# EAGLE schematic REED-tuer (EAGLE 9.3.2)
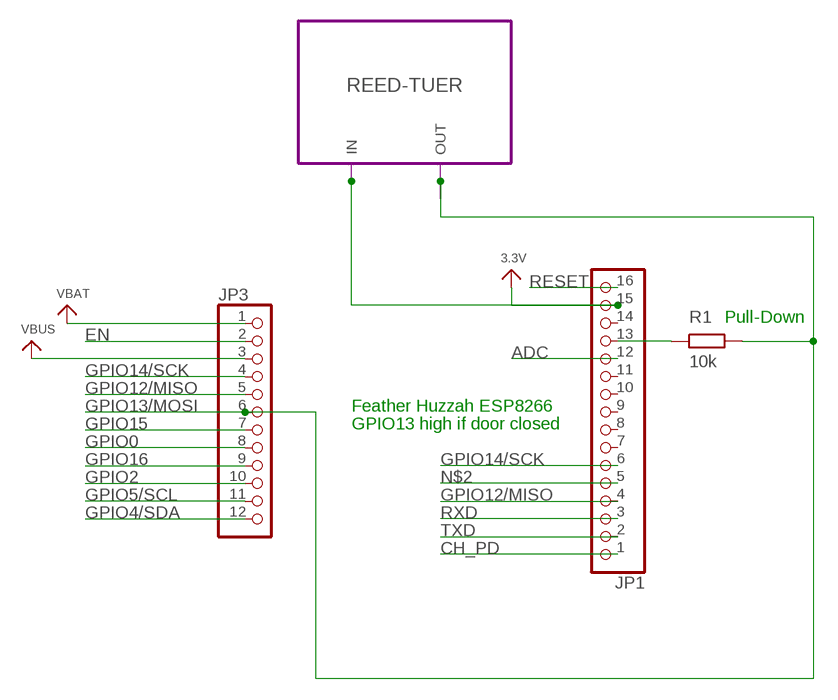
[diagram p0: schematic, sheet 1]

## Parts
JP1  HEADER-1X16ROUND  [1X16_ROUND]
JP3  HEADER-1X12  [1X12_ROUND]
R1  10k  R  (no package)

## Module instances
REED-TUER = REED

## Nets
3.3V: JP1.15
ADC: JP1.12
CH_PD: JP1.1
EN: JP3.2
GPIO0: JP3.8
GPIO2: JP3.10
GPIO4/SDA: JP3.12
GPIO5/SCL: JP3.11
GPIO12/MISO: JP1.4 JP3.5
GPIO13/MOSI: JP3.6 R1.2
GPIO14/SCK: JP1.6 JP3.4
GPIO15: JP3.7
GPIO16: JP3.9
N$1: JP1.13 R1.1
N$2: JP1.5
RESET: JP1.16
RXD: JP1.3
TXD: JP1.2
VBAT: JP3.1
VBUS: JP3.3
Unconnected: JP1.7 JP1.8 JP1.9 JP1.10 JP1.11 JP1.14

## Notes on the sheet
- Pull-Down
- Feather Huzzah ESP8266
- GPIO13 high if door closed

## Library data of the parts
JP1 = microbuilder:HEADER-1X16: PIN HEADER
JP3 = microbuilder:HEADER-1X12
R1 = ngspice-simulation:R: RESISTOR

## Module REED
Ports: IN(io) OUT(io)

### Library data of the parts